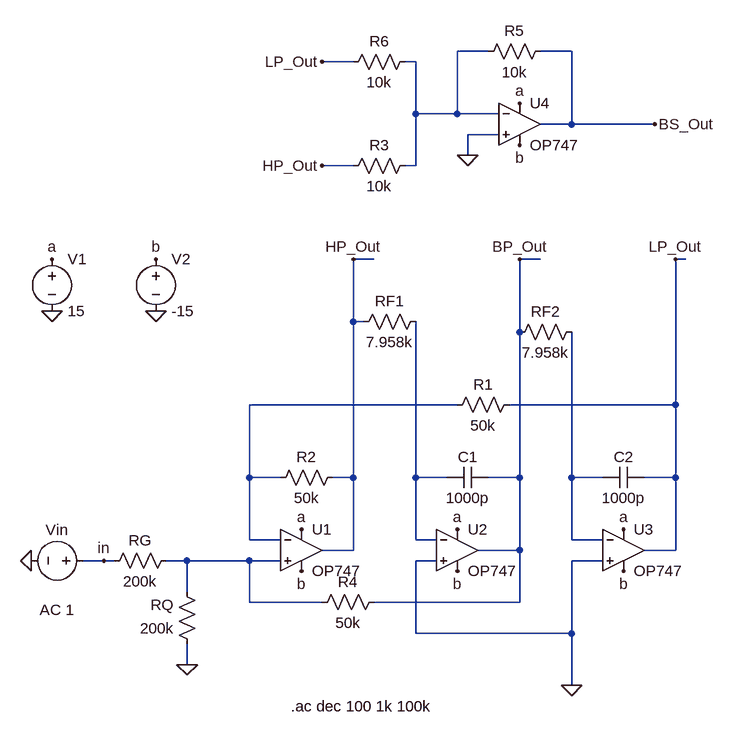
[diagram p0: schematic Notch Filter Schematics.asc]
Notch Filter Schematics.asc, the LTspice schematic file:
Version 4.1
SHEET 1 880 680
WIRE 400 -608 352 -608
WIRE 528 -608 480 -608
WIRE 192 -592 144 -592
WIRE 288 -592 272 -592
WIRE 288 -512 288 -592
WIRE 352 -512 352 -608
WIRE 352 -512 288 -512
WIRE 416 -512 352 -512
WIRE 528 -496 528 -608
WIRE 528 -496 480 -496
WIRE 656 -496 528 -496
WIRE 416 -480 368 -480
WIRE 368 -448 368 -480
WIRE 192 -432 144 -432
WIRE 288 -432 288 -512
WIRE 288 -432 272 -432
WIRE 224 -288 192 -288
WIRE 480 -288 448 -288
WIRE 704 -288 688 -288
WIRE 192 -192 192 -288
WIRE 208 -192 192 -192
WIRE 448 -176 448 -288
WIRE 352 -64 32 -64
WIRE 688 -64 688 -288
WIRE 688 -64 432 -64
WIRE 32 48 32 -64
WIRE 80 48 32 48
WIRE 192 48 192 -192
WIRE 192 48 160 48
WIRE 288 48 288 -192
WIRE 336 48 288 48
WIRE 448 48 448 -176
WIRE 448 48 400 48
WIRE 528 48 528 -176
WIRE 576 48 528 48
WIRE 688 48 688 -64
WIRE 688 48 640 48
WIRE 32 144 32 48
WIRE 80 144 32 144
WIRE 288 144 288 48
WIRE 320 144 288 144
WIRE 528 144 528 48
WIRE 576 144 528 144
WIRE 192 160 192 48
WIRE 192 160 144 160
WIRE 448 160 448 48
WIRE 448 160 384 160
WIRE 688 160 688 48
WIRE 688 160 640 160
WIRE -192 176 -224 176
WIRE -176 176 -192 176
WIRE -64 176 -96 176
WIRE 32 176 -64 176
WIRE 80 176 32 176
WIRE 320 176 288 176
WIRE 576 176 528 176
WIRE -64 224 -64 176
WIRE 32 240 32 176
WIRE 144 240 32 240
WIRE 448 240 448 160
WIRE 448 240 224 240
WIRE 288 288 288 176
WIRE 528 288 528 176
WIRE 528 288 288 288
WIRE -64 336 -64 304
WIRE 528 368 528 288
FLAG 528 368 0
FLAG -64 336 0
FLAG 192 -288 HP_Out
FLAG 448 -288 BP_Out
FLAG 688 -288 LP_Out
FLAG -304 176 0
FLAG -192 176 in
FLAG -272 -208 0
FLAG -112 -208 0
FLAG -272 -288 a
FLAG -112 -288 b
FLAG 112 128 a
FLAG 352 128 a
FLAG 608 128 a
FLAG 112 192 b
FLAG 352 192 b
FLAG 608 192 b
FLAG 448 -528 a
FLAG 448 -464 b
FLAG 144 -432 HP_Out
FLAG 144 -592 LP_Out
FLAG 368 -448 0
FLAG 656 -496 BS_Out
SYMBOL OpAmps\\OP747 112 96 R0
SYMATTR InstName U1
SYMBOL OpAmps\\OP747 352 96 R0
SYMATTR InstName U2
SYMBOL OpAmps\\OP747 608 96 R0
SYMATTR InstName U3
SYMBOL res 240 224 R90
WINDOW 0 0 56 VBottom 2
WINDOW 3 32 56 VTop 2
SYMATTR InstName R4
SYMATTR Value 50k
SYMBOL res 176 32 R90
WINDOW 0 0 56 VBottom 2
WINDOW 3 32 56 VTop 2
SYMATTR InstName R2
SYMATTR Value 50k
SYMBOL cap 640 32 R90
WINDOW 0 0 32 VBottom 2
WINDOW 3 32 32 VTop 2
SYMATTR InstName C2
SYMATTR Value 1000p
SYMBOL cap 400 32 R90
WINDOW 0 0 32 VBottom 2
WINDOW 3 32 32 VTop 2
SYMATTR InstName C1
SYMATTR Value 1000p
SYMBOL res 448 -80 R90
WINDOW 0 0 56 VBottom 2
WINDOW 3 32 56 VTop 2
SYMATTR InstName R1
SYMATTR Value 50k
SYMBOL res 544 -192 R90
WINDOW 0 0 56 VBottom 2
WINDOW 3 32 56 VTop 2
SYMATTR InstName RF2
SYMATTR Value 7.958k
SYMBOL res 304 -208 R90
WINDOW 0 0 56 VBottom 2
WINDOW 3 32 56 VTop 2
SYMATTR InstName RF1
SYMATTR Value 7.958k
SYMBOL res -80 160 R90
WINDOW 0 0 56 VBottom 2
WINDOW 3 32 56 VTop 2
SYMATTR InstName RG
SYMATTR Value 200k
SYMBOL res -48 320 R180
WINDOW 0 36 76 Left 2
WINDOW 3 36 40 Left 2
SYMATTR InstName RQ
SYMATTR Value 200k
SYMBOL voltage -208 176 R90
WINDOW 0 -32 56 VBottom 2
WINDOW 3 32 56 VTop 2
WINDOW 123 60 56 VTop 2
WINDOW 39 0 0 Left 0
SYMATTR InstName Vin
SYMATTR Value ""
SYMATTR Value2 AC 1
SYMBOL voltage -272 -304 R0
WINDOW 123 0 0 Left 0
WINDOW 39 0 0 Left 0
SYMATTR InstName V1
SYMATTR Value 15
SYMBOL voltage -112 -304 R0
WINDOW 123 0 0 Left 0
WINDOW 39 0 0 Left 0
SYMATTR InstName V2
SYMATTR Value -15
SYMBOL OpAmps\\OP747 448 -560 R0
SYMATTR InstName U4
SYMBOL res 288 -448 R90
WINDOW 0 0 56 VBottom 2
WINDOW 3 32 56 VTop 2
SYMATTR InstName R3
SYMATTR Value 10k
SYMBOL res 496 -624 R90
WINDOW 0 0 56 VBottom 2
WINDOW 3 32 56 VTop 2
SYMATTR InstName R5
SYMATTR Value 10k
SYMBOL res 288 -608 R90
WINDOW 0 0 56 VBottom 2
WINDOW 3 32 56 VTop 2
SYMATTR InstName R6
SYMATTR Value 10k
TEXT 96 400 Left 2 !.ac dec 100 1k 100k

The netlist it stands for:
* Notch Filter Schematics.asc
X§U1 N005 N002 a b HP_Out OP747  ; pins In+ In- V+ V- OUT
X§U2 0 N003 a b BP_Out OP747  ; pins In+ In- V+ V- OUT
X§U3 0 N004 a b LP_Out OP747  ; pins In+ In- V+ V- OUT
R4 BP_Out N005 50k
R2 HP_Out N002 50k
C2 LP_Out N004 1000p
C1 BP_Out N003 1000p
R1 LP_Out N002 50k
RF2 N004 BP_Out 7.958k
RF1 N003 HP_Out 7.958k
RG N005 in 200k
RQ 0 N005 200k
Vin in 0 AC 1
V1 a 0 15
V2 b 0 -15
X§U4 0 N001 a b BS_Out OP747  ; pins In+ In- V+ V- OUT
R3 N001 HP_Out 10k
R5 BS_Out N001 10k
R6 N001 LP_Out 10k
.ac dec 100 1k 100k
.backanno
.end